# Altium schematic sheet Planter.SchDoc: Plant - Block Diagram
size A4; Author: Carlos de la Fuente; DrawnBy: Carlos de la Fuente; Engineer: Carlos de la Fuente; DocumentNumber: 1; Revision: 0.2; SheetNumber: 1; SheetTotal: 5
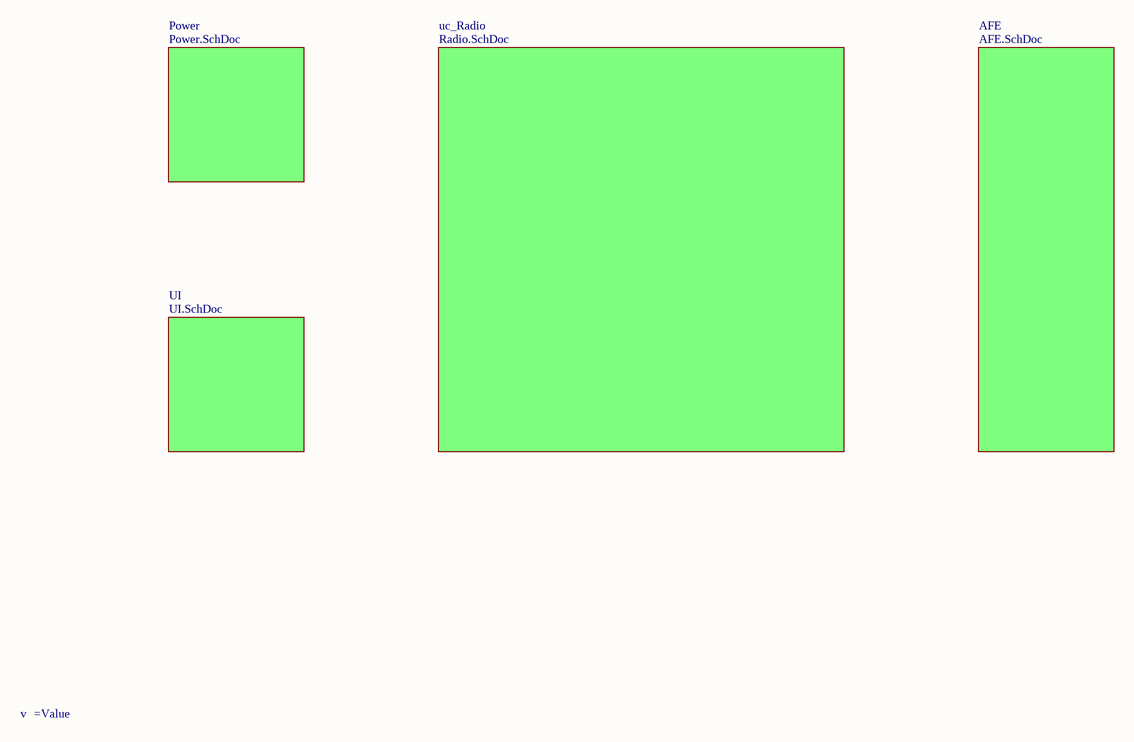
[diagram p0: Planter.SchDoc]

## Parts
v  Version  [VERSION]  (value not drawn)  (no BOM)

## Sub-sheets
AFE = AFE.SchDoc: no entries
Power = Power.SchDoc: no entries
uc_Radio = Radio.SchDoc: no entries
UI = UI.SchDoc: no entries

## Notes on the sheet
- Title
- Size:
- Date:
- A4
- Project:
- Time:
- Sheet
- Drawn By:
- Revision:
- of
- File:

## Library data of the parts
v = Version: Silkscreen version; Value: 0.2; Part Number: Version; Revision Date: 15/04/2019; Creation Date: 15/04/2019